# EAGLE schematic untitled (EAGLE 8.7.1)
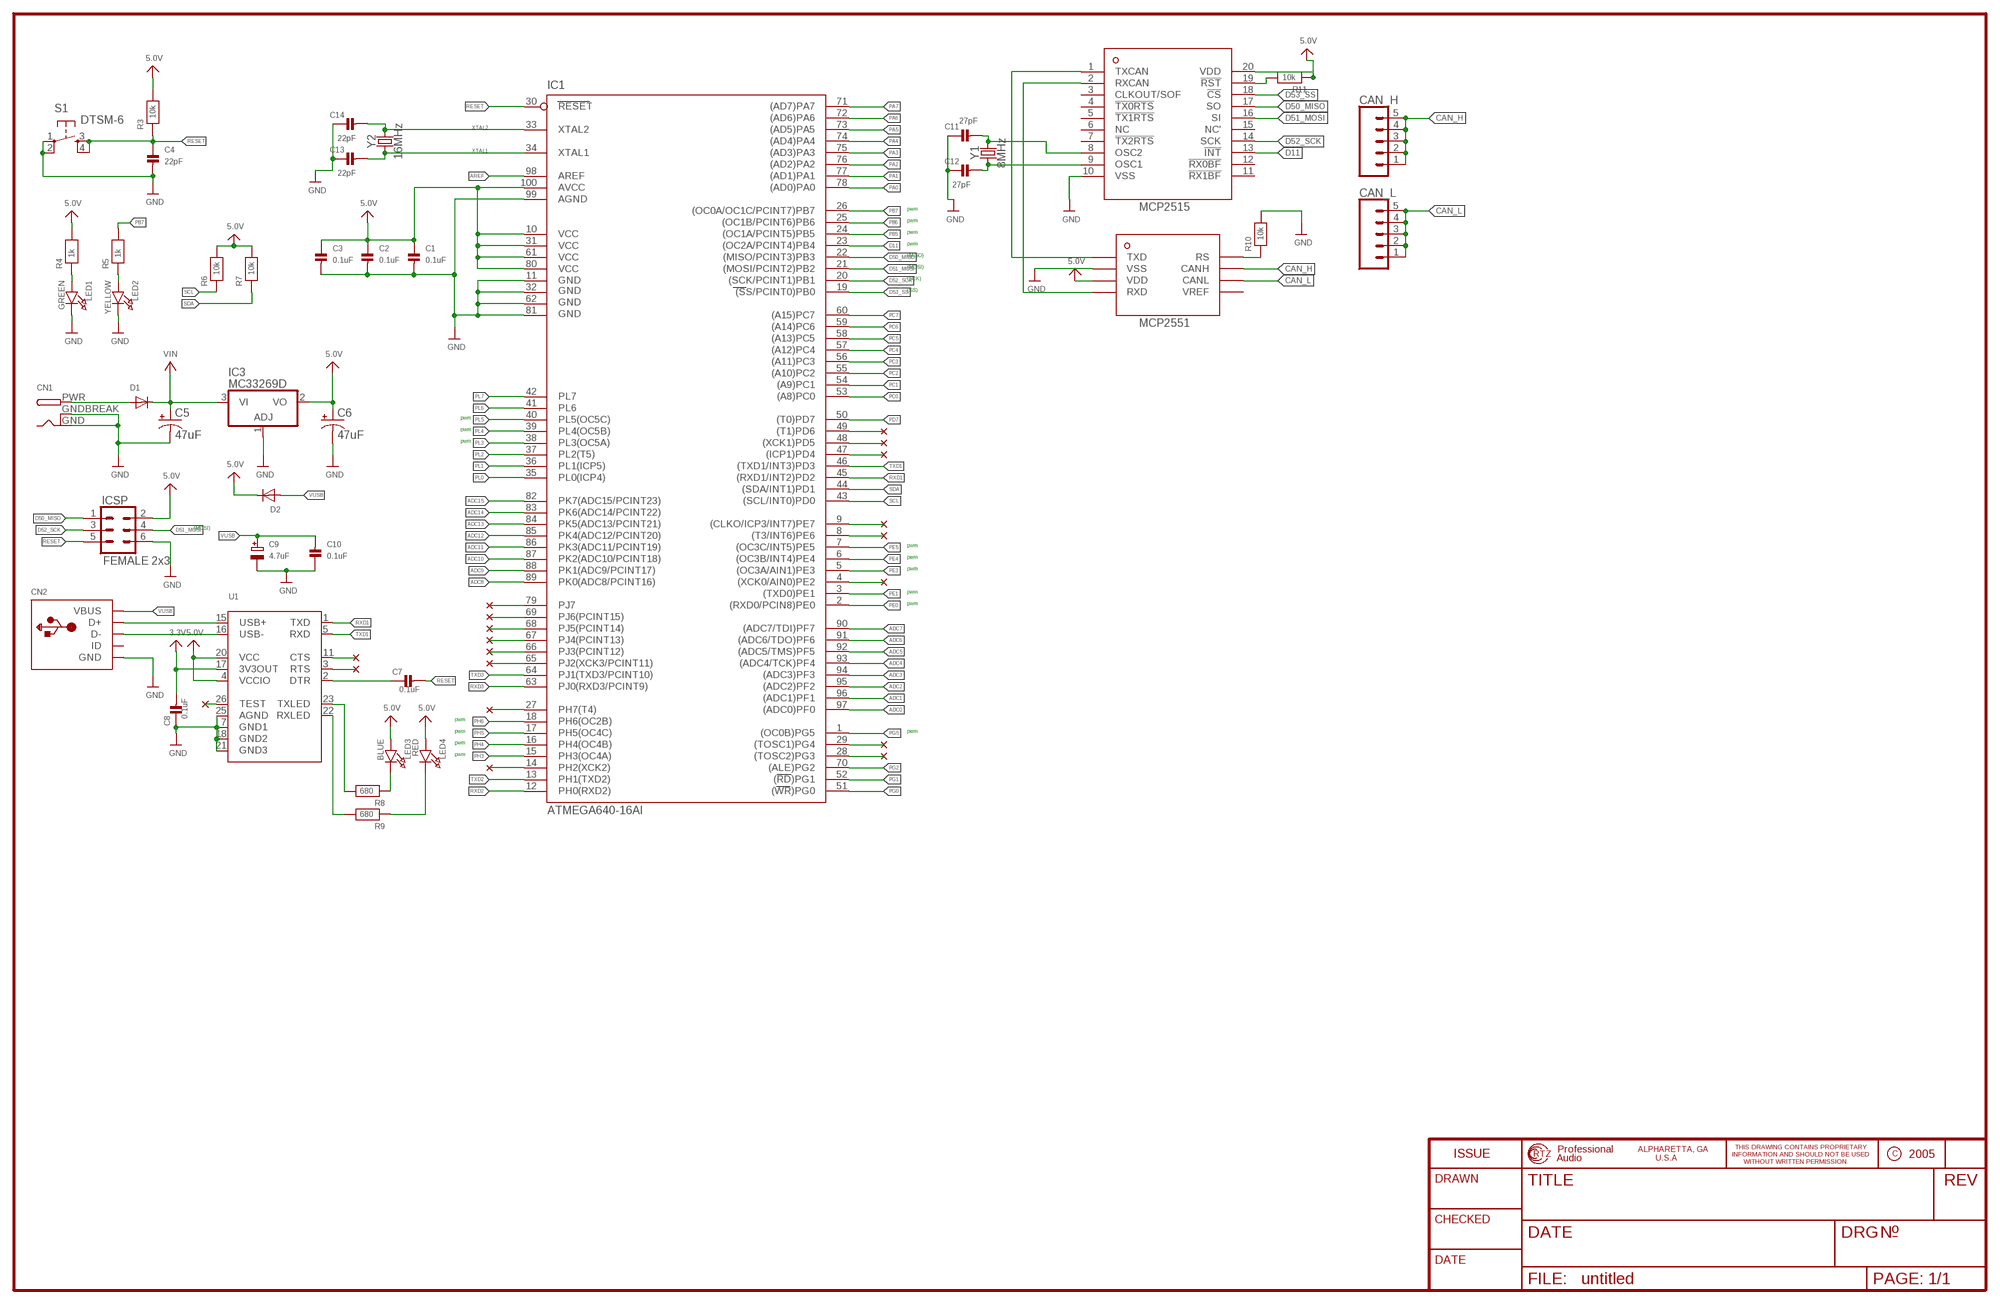
[diagram p0: schematic, sheet 1]

## Parts
C1  0.1uF  CAP_CERAMIC0805  [0805]
C2  0.1uF  CAP_CERAMIC0805  [0805]
C3  0.1uF  CAP_CERAMIC0805  [0805]
C4  22pF  CAP_CERAMIC0805  [0805]
C5  47uF  CPOL-USD  [PANASONIC_D]
C6  47uF  CPOL-USD  [PANASONIC_D]
C7  0.1uF  CAP_CERAMIC0805  [0805]
C8  0.1uF  CAP_CERAMIC0805  [0805]
C9  4.7uF  CAP_TANTALUMD/7343_WAVE  [EIA7343-31/D-W]
C10  0.1uF  CAP_CERAMIC0805  [0805]
C11  27pF  CAP_CERAMIC0805  [0805]
C12  27pF  CAP_CERAMIC0805  [0805]
C13  22pF  CAP_CERAMIC0805  [0805]
C14  22pF  CAP_CERAMIC0805  [0805]
CAN_H  CONN_05SCREW  [SCREWTERMINAL-3.5MM-5]
CAN_L  CONN_05SCREW  [SCREWTERMINAL-3.5MM-5]
CN1  DCBARRELPTH  [DCJACK_2MM_PTH]
CN2  USBMINIB  [USB-MINIB]
D1  DIODESOD-123  [SOD-123]
D2  DIODESOD-123  [SOD-123]
IC1  ATMEGA640-16AI  [TQFP100]
IC3  MC33269D  [DPACK]
ICSP  FEMALE 2x3  CONN_03X2FEMALE  [2X3]
LED1  GREEN  LED0805  [CHIPLED_0805]
LED2  YELLOW  LED0805  [CHIPLED_0805]
LED3  BLUE  LED0805  [CHIPLED_0805]
LED4  RED  LED0805  [CHIPLED_0805]
R3  10k  RESISTOR0805  [0805]
R4  1k  RESISTOR0805  [0805]
R5  1k  RESISTOR0805  [0805]
R6  10k  RESISTOR0805  [0805]
R7  10k  RESISTOR0805  [0805]
R8  680  RESISTOR0805  [0805]
R9  680  RESISTOR0805  [0805]
R10  10k  RESISTOR0805  [0805]
R11  10k  RESISTOR0805  [0805]
S1  DTSM-6  [DTSM-6]
U1  FT232RLSSOP28  [SSOP28DB]
U$6  NC  [NC]
U$7  NC  [NC]
U$8  NC  [NC]
U$9  NC  [NC]
U$10  NC  [NC]
U$11  NC  [NC]
U$12  NC  [NC]
U$13  NC  [NC]
U$14  NC  [NC]
U$15  NC  [NC]
U$16  NC  [NC]
U$17  NC  [NC]
U$18  NC  [NC]
U$19  NC  [NC]
U$20  NC  [NC]
U$21  NC  [NC]
U$37  NC  [NC]
U$38  NC  [NC]
U$42  NC  [NC]
U$45  MCP2515  [TSSOP20]
U$46  MCP2551  [SOIC-8]
Y1  8MHz  CRYSTALPTH-HC49US  [HC49US]
Y2  16MHz  CRYSTALPTH-HC49US  [HC49US]

## Nets
3.3V: C8.2 U1.17(3V3OUT)
5.0V: C1.1 C2.1 C3.1 C6.+ D2.C IC1.10(VCC) IC1.31(VCC1) IC1.61(VCC2) IC1.80(VCC3) IC1.100(AVCC) IC3.2(VO) ICSP.2 LED3.A LED4.A R3.2 R4.2 R6.2 R7.2 R11.1 U1.4(VCCIO) U1.20(VCC) U$45.20(VDD) U$46.VDD
ADC0: IC1.97((ADC0)PF0)
ADC1: IC1.96((ADC1)PF1)
ADC2: IC1.95((ADC2)PF2)
ADC3: IC1.94((ADC3)PF3)
ADC4: IC1.93((ADC4/TCK)PF4)
ADC5: IC1.92((ADC5/TMS)PF5)
ADC6: IC1.91((ADC6/TDO)PF6)
ADC7: IC1.90((ADC7/TDI)PF7)
ADC8: IC1.89(PK0(ADC8/PCINT16))
ADC9: IC1.88(PK1(ADC9/PCINT17))
ADC10: IC1.87(PK2(ADC10/PCINT18))
ADC11: IC1.86(PK3(ADC11/PCINT19))
ADC12: IC1.85(PK4(ADC12/PCINT20))
ADC13: IC1.84(PK5(ADC13/PCINT21))
ADC14: IC1.83(PK6(ADC14/PCINT22))
ADC15: IC1.82(PK7(ADC15/PCINT23))
AREF: IC1.98(AREF)
CAN_H: CAN_H.1 CAN_H.2 CAN_H.3 CAN_H.4 CAN_H.5 U$46.CANH
CAN_L: CAN_L.1 CAN_L.2 CAN_L.3 CAN_L.4 CAN_L.5 U$46.CANL
D11: IC1.23((OC2A/PCINT4)PB4) U$45.13(!INT)
D50_MISO: IC1.22((MISO/PCINT3)PB3) ICSP.1 U$45.17(SO)
D51_MOSI: IC1.21((MOSI/PCINT2)PB2) ICSP.4 U$45.16(SI)
D52_SCK: IC1.20((SCK/PCINT1)PB1) ICSP.3 U$45.14(SCK)
D53_SS: IC1.19((SS/PCINT0)PB0) U$45.18(!CS)
GND: C1.2 C2.2 C3.2 C4.2 C5.- C6.- C8.1 C9.- C10.1 C11.1 C12.1 C13.1 C14.1 CN1.GND CN1.GNDBREAK CN2.GND IC1.11(GND) IC1.32(GND1) IC1.62(GND2) IC1.81(GND3) IC1.99(AGND) IC3.1(ADJ) ICSP.6 LED1.C LED2.C R10.2 S1.1 S1.2 U1.7(GND1) U1.18(GND2) U1.21(GND3) U1.25(AGND) U$45.10(VSS) U$46.VSS
N$1: IC1.65(PJ2(XCK3/PCINT11))
N$2: IC1.66(PJ3(PCINT12))
N$4: IC1.67(PJ4(PCINT13))
N$5: IC1.68(PJ5(PCINT14))
N$6: IC1.69(PJ6(PCINT15))
N$7: IC1.79(PJ7)
N$8: IC1.27(PH7(T4))
N$9: IC1.9((CLKO/ICP3/INT7)PE7)
N$10: IC1.49((T1)PD6)
N$11: IC1.48((XCK1)PD5)
N$12: IC1.47((ICP1)PD4)
N$13: IC1.14(PH2(XCK2))
N$14: IC1.8((T3/INT6)PE6)
N$15: CN1.PWR D1.A
N$16: CN2.D+ U1.15(USB+)
N$17: CN2.D- U1.16(USB-)
N$18: IC1.4((XCK0/AIN0)PE2)
N$19: LED1.A R4.1
N$20: LED2.A R5.1
N$21: LED3.C R8.1
N$22: R9.2 U1.22(RXLED)
N$23: R8.2 U1.23(TXLED)
N$24: LED4.C R9.1
N$25: IC1.29((TOSC1)PG4)
N$26: IC1.28((TOSC2)PG3)
N$27: U$45.1(TXCAN) U$46.TXD
N$28: U1.26(TEST)
N$29: U1.11(CTS)
N$30: U1.3(RTS)
N$31: C7.1 U1.2(DTR)
N$32: U$45.2(RXCAN) U$46.RXD
N$33: R10.1 U$46.RS
N$34: C11.2 U$45.8(OSC2) Y1.2
N$36: C12.2 U$45.9(OSC1) Y1.1
N$41: R11.2 U$45.19(!RST)
PA0: IC1.78((AD0)PA0)
PA1: IC1.77((AD1)PA1)
PA2: IC1.76((AD2)PA2)
PA3: IC1.75((AD3)PA3)
PA4: IC1.74((AD4)PA4)
PA5: IC1.73((AD5)PA5)
PA6: IC1.72((AD6)PA6)
PA7: IC1.71((AD7)PA7)
PB5: IC1.24((OC1A/PCINT5)PB5)
PB6: IC1.25((OC1B/PCINT6)PB6)
PB7: IC1.26((OC0A/OC1C/PCINT7)PB7) R5.2
PC0: IC1.53((A8)PC0)
PC1: IC1.54((A9)PC1)
PC2: IC1.55((A10)PC2)
PC3: IC1.56((A11)PC3)
PC4: IC1.57((A12)PC4)
PC5: IC1.58((A13)PC5)
PC6: IC1.59((A14)PC6)
PC7: IC1.60((A15)PC7)
PD7: IC1.50((T0)PD7)
PE0: IC1.2((RXD0/PCIN8)PE0)
PE1: IC1.3((TXD0)PE1)
PE3: IC1.5((OC3A/AIN1)PE3)
PE4: IC1.6((OC3B/INT4)PE4)
PE5: IC1.7((OC3C/INT5)PE5)
PG0: IC1.51((WR)PG0)
PG1: IC1.52((RD)PG1)
PG2: IC1.70((ALE)PG2)
PG5: IC1.1((OC0B)PG5)
PH3: IC1.15(PH3(OC4A))
PH4: IC1.16(PH4(OC4B))
PH5: IC1.17(PH5(OC4C))
PH6: IC1.18(PH6(OC2B))
PL0: IC1.35(PL0(ICP4))
PL1: IC1.36(PL1(ICP5))
PL2: IC1.37(PL2(T5))
PL3: IC1.38(PL3(OC5A))
PL4: IC1.39(PL4(OC5B))
PL5: IC1.40(PL5(OC5C))
PL6: IC1.41(PL6)
PL7: IC1.42(PL7)
RESET: C4.1 C7.2 IC1.30(RESET) ICSP.5 R3.1 S1.3 S1.4
RXD1: IC1.45((RXD1/INT2)PD2) U1.1(TXD)
RXD2: IC1.12(PH0(RXD2))
RXD3: IC1.63(PJ0(RXD3/PCINT9))
SCL: IC1.43((SCL/INT0)PD0) R6.1
SDA: IC1.44((SDA/INT1)PD1) R7.1
TXD1: IC1.46((TXD1/INT3)PD3) U1.5(RXD)
TXD2: IC1.13(PH1(TXD2))
TXD3: IC1.64(PJ1(TXD3/PCINT10))
VIN: C5.+ D1.C IC3.3(VI)
VUSB: C9.+ C10.2 CN2.VBUS D2.A
XTAL1: C13.2 IC1.34(XTAL1) Y2.1
XTAL2: C14.2 IC1.33(XTAL2) Y2.2
Unconnected: CN2.ID U$45.3(CLKOUT/SOF) U$45.4(!TX0RTS) U$45.5(!TX1RTS) U$45.6(NC) U$45.7(!TX2RTS) U$45.11(!RX1BF) U$45.12(!RX0BF) U$45.15(NC') U$46.VREF

## Notes on the sheet
- pwm
- pwm
- pwm
- pwm
- (MISO)
- (MOSI)
- (SCK)
- (SS)
- pwm
- pwm
- pwm
- (MOSI)
- pwm
- pwm
- pwm
- pwm
- pwm
- pwm
- pwm | pwm
- pwm
- pwm

## Library data of the parts
C1-C4 C7 C8 C10-C14 = microbuilder:CAP_CERAMIC: Ceramic Capacitors 0402 - 0402 Surface Mount Capacitors 16pF 50V 5% [Digikey: 445-4899-2-ND] 18pF 50V 5% [Digikey: 490-1281-2-ND] 22pF 50V 5% [Digikey: 490-1283-2-ND] 68pF 50V 5% [Digikey: 490-1289-2-ND] 0.1uF 10V 10% [Digikey: 490-1318-2-ND] 1.0uF 6.3V 10% [Digikey: 490-1320-2-ND] 0603 - 0603 Surface Mount Capacitors 16 pF 50V 5% [Digikey: 445-5051-2-ND] 22 pF 50V [Digikey: PCC220ACVTR-ND] 33 pF 50V 5% [Digikey: 490-1415-1-ND] 56pF 50V 5% [Digikey: 490-1421-1-ND] 220pF 50V 5% [Digikey: 445-1285-1-ND] 680 pF 50V 2200 pF 50V 5% C0G [Digikey: 445-1297-1-ND] 5600 pF 100V 5% X7R [Digikey: 478-3711-1-ND] 0.1 µF 25V 10% [Digikey: PCC2277TR-ND] 0.22 µF 16V 10% X7R [Digikey: 445-1318-1-ND] 1.0 µF 25V 10% [Digikey: 445-5146-2-ND] 0603 - RF Specific 3pF 250V +/-0.1pF RF [Digikey: 712-1347-1-ND] 18 pF 250V 5% [Digikey: 478-3505-1-ND or 712-1322-1-ND] 56 pF 250V 5% C0G RF [Digikey: 490-4867-1-ND] 68 pF 250V RF [Digikey: 490-4868-1-ND] 0805 - 0805 Surface Mount Capacitors 220 pF 250V 2% RF Ceramic Capacitor [Digikey: 712-1398-1-ND] 1000 pF 50V 2% NP0 Ceramic Capacitor [Digikey: 478-3760-1-ND] 0.1 µF 25V 10% Ceramic Capacitor [Digikey: PCC1828TR-ND] 1.0 µF 16V 10% Ceramic Capacitor[Digikey: 490-1691-2-ND] 10.0 µF 10V 10% Ceramic Capacitor[Digikey: 709-1228-1-ND] 10.0 uF 16V 10% Ceramic Capacitor [Digikey: 478-5165-2-ND] 47 uF 6.3V 20% Ceramic Capacitor [Digikey: 587-1779-1-ND or 399-5506-1-ND] 1206 - 1206 Surface Mount Capacitors 47uF 10V 20% Ceramic Capacitor [Digikey: 490-5528-1-ND or 399-5508-1-ND or 445-6010-1-ND]
C5 C6 = rcl:CPOL-US: POLARIZED CAPACITOR, American symbol; SPICEPREFIX: C
C9 = microbuilder:CAP_TANTALUM: Tantalum Capacitors Wave footprints have larger pads and are meant to be used for hand soldering. Reflow footprints are optimised for solder paste and a reflow oven. EIA3216-18/A-[R/W] - Size A / 3216-18 / 1206 footprint 4.7µF 25V 10% Tantalum Capacitor 10µF 16V 10% Tantalum Capacitor [Digikey: 495-2236-2-ND] EIA3528-21/B-[R/W] - Size B / 3528-21 47µF 10V 10% Tantalum Capactior [Digikey: 495-2216-1-ND] EIA6032-28/C-[R/W] - Size C / 6032-28 10µF 35V 20% Tantalum Capacitor [Digikey: 495-2285-1-ND] 100µF 16V 10% Tantalum Capactior [Digikey: 399-5214-1-ND]
CAN_H CAN_L = SparkFun-Connectors:CONN_05: Multi connection point. Often used as Generic Header-pin footprint for 0.1 inch spaced/style header connections On any of the 0.1 inch spaced packages, you can populate with these: Break Away Headers - Straight <https://www.sparkfun.com/products/116> (PRT-00116) Break Away Male Headers - Right Angle <https://www.sparkfun.com/products/553> (PRT-00553) Female Headers <https://www.sparkfun.com/products/115> (PRT-00115) Break Away Headers - Machine Pin <https://www.sparkfun.com/products/117> (PRT-00117) Break Away Female Headers - Swiss Machine Pin <https://www.sparkfun.com/products/743> (PRT-00743) For SCREWTERMINALS and SPRING TERMINALS visit here: Screw Terimnals on SparkFun.com <https://www.sparkfun.com/search/results?term=Screw+Terminals> (5mm/3.5mm/2.54mm spacing) This device is also useful as a general connection point to wire up your design to another part of your project. Our various solder wires solder well into these plated through hole pads. Hook-Up Wire - Assortment (Stranded, 22 AWG) <https://www.sparkfun.com/products/11375> (PRT-11375) Hook-Up Wire - Assortment (Solid Core, 22 AWG) <https://www.sparkfun.com/products/11367> (PRT-11367) View the entire wire category on our website here <https://www.sparkfun.com/categories/141> Special notes: Molex polarized connector foot print use with SKU : PRT-08231 with associated crimp pins and housings. 1MM SMD Version SKU: PRT-10208; PROD_ID: Combine 8288+8399
CN1 = adafruit:DCBARREL: 2.0mm DC Barrel Jack DCJACK_2MM_PTH - Through Hole Jack (4UConnector: 05537)
CN2 = adafruit:USB: USB Connectors USBMINIB - Surface Mount Female Mini-B USB Connector 4UConnector: 06564 By microbuilder.eu Thru-hole RA Female Mini-B USB Connector 4UConnector: 18732 By ladyada.net
D1 D2 = microbuilder:DIODE: Diode SMADIODE - SMA Surface Mount Package 20V 1A Schottky Diode Digikey (500mV @ 1A, 500uA Vr @ 20V): 641-1014-6-ND 10V 2A Schottky Diode Digikey (350mV @ 2A, 700uA Vr @ 10V): MBRA210LT3 SOD-123 30V 200mA (800mV Vf, 2uA Vr @ 25V) Schottky Diode (very fast switching for boost, etc.) - Digikey: BAT54T1GOSTR-ND 30V 500mA (430mV Vf, 130uA Vr @ 30V) Schottky Diode - Digikey: B0530W-FDICT-ND MBR120 1A 20V (0.34Vf) Schottky Diode - Digikey: MBR120VLSFT1GOSCT-ND SOD-323 10V 570mA (380mV Vf, 3ns) Schottky Diode - Digikey: ZLLS410CT-ND 1N4148WS - 75V 150mA (1V Vf @ 10mA, 4ns) Simple Diode - Digikey: 1N4148WSFSCT-ND, Mouser: 512-1N4148WS SOD-523 BAT54 30V 200mA Schottky (0.8 Vf @ 100mA, 5ns) - Digikey: BAT54XV2CT-ND 30V 30mA Schottky Diode (RB751S-40TE61) - Digikey: RB751S-40TE61CT-ND SOT23-R/W - SOT23 Package (R = Solder Paste/Reflow Ovens, W = Hand-Soldering) BAT54Film 40V 300mA - Digikey: 497-7162-1-ND DO-1N4148 Through Hole Small Current Diode (any model)
IC1 = atmel-2005:ATMEGA*: MICROCONTROLLER 64/128/256 Kbytes FLASH 4 Kbytes EEPROM 8 Kbytes SRAM 86 General Purpose I/O pins 12-channels16-bit PWM 4 x Serial USARTs 16-channels 10-bit A/D
IC3 = linear:MC33269?*: Adjustable Output Low Dropout Voltage Regulator 800 mA Source: http://www.onsemi.com/pub/Collateral/MC33269-D.PDF
ICSP = SparkFun-Connectors:CONN_03X2: Multi connection point. Often used as Generic Header-pin footprint for 0.1 inch spaced/style header connections You can populate with any combo of single row headers, but if you'd like an exact match, check these: Header - 2x3 (Male, 0.1") <https://www.sparkfun.com/products/12807> (PRT-12807) Header - 2x3 (Female, 0.1") <https://www.sparkfun.com/products/13010> (PRT-13010) 2x3 Pin Shrouded Header <https://www.sparkfun.com/products/10877> (PRT-10877) On any of the 0.1 inch spaced packages, you can populate with these: Break Away Headers - Straight <https://www.sparkfun.com/products/116> (PRT-00116) Break Away Male Headers - Right Angle <https://www.sparkfun.com/products/553> (PRT-00553) Female Headers <https://www.sparkfun.com/products/115> (PRT-00115) Break Away Headers - Machine Pin <https://www.sparkfun.com/products/117> (PRT-00117) Break Away Female Headers - Swiss Machine Pin <https://www.sparkfun.com/products/743> (PRT-00743) Special note: the shrouded connector mates well with our 3x2 ribbon cables: Ribbon Crimp Connector - 6-pin (2x3, Female) <https://www.sparkfun.com/products/10651> (PRT-10651) Ribbon Cable - 6 wire (15ft) <https://www.sparkfun.com/products/10646> (PRT-10646); PROD_ID: CONN-11566
LED1-LED4 = microbuilder:LED: LED 0603 - 0603 Surface Mount Package 2mA: Green LED - Low Power (3.9mcd, 2ma, 1.7Vf) - Digikey: 475-2709-2-ND Orange LED - Low Power (9.8mcd, 2ma, 1.8Vf) - Digikey: 475-1194-2-ND Red LED - Low Power (5mcd, 2ma, 1.8Vf) - Digikey: 475-1195-2-ND Yellow LED - Low Power (7mcd, 2ma, 1.8Vf) - Digikey: 475-1196-2-ND 5mA: Blue LED - Low Power (17mcd, 5ma, 2.9Vf) - Digikey: LNJ937W8CRACT-ND 0805 - 0805 Surface Mount Package 2mA: Red LED (8.8mcd, 2mA, 1.8Vf, Clear) - Low Power [Digikey: 475-2510-1-ND] Green LED (5mcd, 2mA, 1.8Vf, Clear) - Low Power [Digikey: 475-2730-1-ND] Yellow LED (11.3mcd, 2mA, 1.8Vf, Clear) - Low Power [Digikey: 475-2555-1-ND] 20mA: Red LED (104mcd, 20mA, Diffused) - LS R976 [Digikey: 475-1278-6-ND] Red LED (12mcd, 20mA, 2.0Vf, Clear) - APT2012EC [Digikey: 754-1128-1-ND] Green LED (15mcd, 20mA, 2.2Vf, Clear) - APT2012GC [Digikey: 754-1131-1-ND] Orange LED (160mcd, 20mA, 2.1Vf, Clear) - APT2012SECK [Digikey: 754-1130-1-ND] 1206 - 1206 Surface Mount Package Green LED (26mcd, 20mA, Diffused) - LG N971 [Digikey: 475-1407-6-ND] Red LED (15mcd, 20mA, Diffused) - LH N974 [Digikey: 475-1416-6-ND]
R3-R11 = microbuilder:RESISTOR: Resistors 0402 - 0402 Surface Mount Package 22 Ohm 1% 1/16W [Digikey: 311-22.0LRTR-ND] 33 Ohm 5% 1/16W 1.0K 5% 1/16W 1.5K 5% 1/16W 2.0K 1% 1/16W 10.0K 1% 1/16W [Digikey: 311-10.0KLRTR-ND] 10.0K 5% 1/16W [Digikey: RMCF0402JT10K0TR-ND] 12.1K 1% 1/16W [Digikey: 311-22.0LRTR-ND] 100.0K 5% 1/16W 0603 - 0603 Surface Mount Package 0 Ohm 1/10 Watt 1% Resistor 15 Ohm 1/10 Watt 1% Resistor 33 Ohm 1/10 Watt 1% Resistor 49.9 Ohm 1/10 Watt 1% Resistor 100 Ohm 1/10 Watt 1% Resistor 150 Ohm 1/10 Watt 1% Resistor 240 Ohm 1/10 Watt 1% Resistor 390 Ohm 1/10 Watt 1% Resistor 560 Ohm 1/10 Watt 1% Resistor 680 Ohm 1/10 Watt 1% Resistor 750 Ohm 1/10 Watt 1% Resistor 1.0K Ohm 1/10 Watt 1% Resistor 1.5K Ohm 1/10 Watt 1% Resistor 2.0K Ohm 1/10 Watt 1% Resistor 2.2K Ohm 1/10 Watt 1% Resistor 3.3K Ohm 1/10 Watt 1% Resistor 4.7K Ohm 1/10 Watt 1% Resistor 10.0K Ohm 1/10 Watt 1% Resistor 12.0K Ohm 1/10 Watt 1% Resistor 12.1K Ohm 1/10 Watt 1% Resistor 20.0K Ohm 1/10 Watt 1% Resistor 33.0K Ohm 1/10 Watt 1% Resistor 100.0K Ohm 1/10 Watt 1% Resistor 0805 - 0805 Surface Mount Package 0 Ohm 1/8 Watt 1% Resistor 33 Ohm 1/8 Watt 1% Resistor 100 Ohm 1/8 Watt 1% Resistor 150 Ohm 1/8 Watt 1% Resistor 200 Ohm 1/8 Watt 1% Resistor 240 Ohm 1/8 Watt 1% Resistor 330 Ohm 1/8 Watt 1% Resistor 390 Ohm 1/8 Watt 1% Resistor 470 Ohm 1/8 Watt 1% Resistor 1.0K Ohm 1/8 Watt 1% Resistor 1.5K Ohm 1/8 Watt 1% Resistor 2.0K Ohm 1/8 Watt 1% Resistor 4.7K Ohm 1/8 Watt 1% Resistor 5.1K Ohm 1/8 Watt 1% Resistor 5.6K Ohm 1/8 Watt 1% Resistor 10.0K Ohm 1/8 Watt 1% Resistor 22.0K Ohm 1/8 Watt 1% Resistor 33.0K Ohm 1/8 Watt 1% Resistor 100K Ohm 1/8 Watt 1% Resistor 1206 - 1206 Surface Mount Package 2012 - 2010 Surface Mount Package 0.11 Ohm 1/2 Watt 1% Resistor - Digikey: RHM.11UCT-ND
S1 = switch-tact:DTSM-6
U1 = microbuilder:FT232RL: FTDI FT232RL USB TO RS232 Converter Digikey: 768-1007-1-ND
U$6-U$21 U$37 U$38 U$42 = divers:NC: No connect symbol
U$45 = MCP2515:MCP2515: Microchip Technology’s MCP2515 is a stand-alone Controller Area Network (CAN) controller that implements the CAN specification, version 2.0B. It is capable of transmitting and receiving both standard and extended data and remote frames. The MCP2515 has two acceptance masks and six acceptance filters that are used to filter out unwanted messages, thereby reducing the host MCUs overhead. The MCP2515 interfaces with microcontrollers (MCUs) via an industry standard Serial Peripheral Interface (SPI).
U$46 = MCP2551:MCP2551: The MCP2551 is a high-speed CAN, fault-tolerant device that serves as the interface between a CAN protocol controller and the physical bus. The MCP2551 provides differential transmit and receive capability for the CAN protocol controller and is fully compatible with the ISO-11898 standard, including 24V requirements. It will operate at speeds of up to 1 Mb/s. Typically, each node in a CAN system must have a device to convert the digital signals generated by a CAN controller to signals suitable for transmission over the bus cabling (differential output). It also provides a buffer between the CAN controller and the high-voltage spikes that can be generated on the CAN bus by outside sources (EMI, ESD, electrical transients, etc.).
Y1 Y2 = SparkFun-Clocks:CRYSTAL: Crystals (Generic) These are passive quartz crystals, which can be used as a clock source for a microcontroller. Crystal's are two-terminal devices. They require external "load" capacitors to generate an oscillating signal.